# EAGLE design EasyDriver_v44 (EAGLE 5.10)
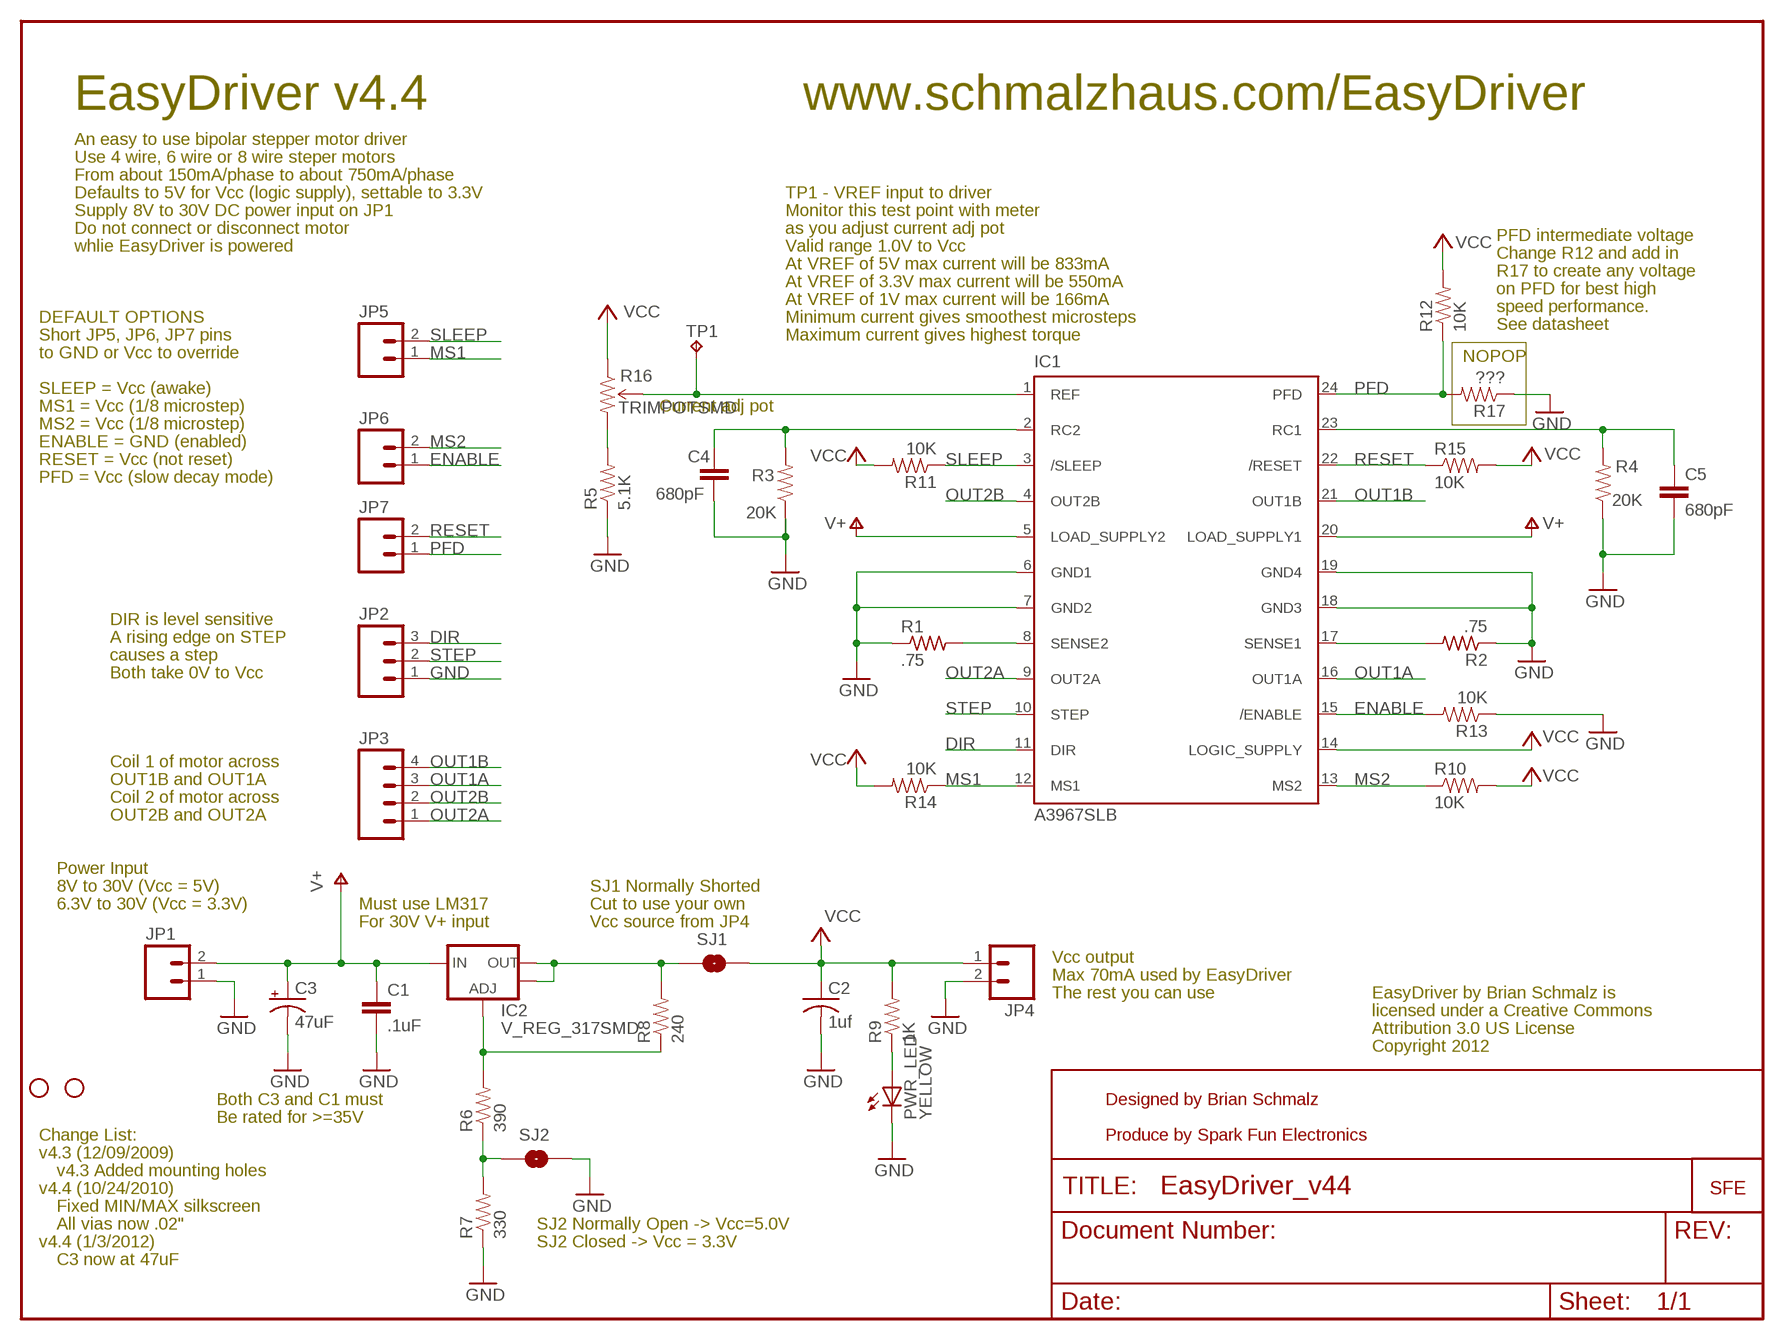
[diagram p0: schematic, sheet 1]

## Parts
C1  .1uF  CAP0603  [0603]
C2  1uf  C-USC0603  [C0603]
C3  47uF  CPOL-USD  [PANASONIC_D]
C4  680pF  CAP0402  [C0402]
C5  680pF  CAP0402  [C0402]
IC1  A3967SLB  [SO24W]
IC2  V_REG_317SMD  [SOT223]
JP1  M021X02_NO_SILK  [1X02_NO_SILK]
JP2  M031X03_NO_SILK  [1X03_NO_SILK]
JP3  M041X04_NO_SILK  [1X04_NO_SILK]
JP4  M021X02_NO_SILK  [1X02_NO_SILK]
JP5  M021X02_NO_SILK  [1X02_NO_SILK]
JP6  M021X02_NO_SILK  [1X02_NO_SILK]
JP7  M021X02_NO_SILK  [1X02_NO_SILK]
JP8  STAND-OFF  [STAND-OFF]
JP9  STAND-OFF  [STAND-OFF]
PWR_LED  YELLOW  LED0603  [LED-0603]
R1  .75  R-US_R0805  [R0805]
R2  .75  R-US_R0805  [R0805]
R3  20K  RESISTOR0402  [C0402]
R4  20K  RESISTOR0402  [C0402]
R5  5.1K  RESISTOR0402  [C0402]
R6  390  RESISTOR0402  [C0402]
R7  330  RESISTOR0402  [C0402]
R8  240  RESISTOR0402  [C0402]
R9  1K  RESISTOR0402  [C0402]
R10  10K  RESISTOR0402  [C0402]
R11  10K  RESISTOR0402  [C0402]
R12  10K  RESISTOR0402  [C0402]
R13  10K  RESISTOR0402  [C0402]
R14  10K  RESISTOR0402  [C0402]
R15  10K  RESISTOR0402  [C0402]
R16  TRIMPOTSMD  [TRIMPOT-3MM]
R17  ???  RESISTOR0402  [C0402]
SJ1  SOLDERJUMPERTRACE  [SJ_2S-TRACE]
SJ2  SOLDERJUMPERNO  [SJ_2S-NO]
TP1  TPPAD1-13  [P1-13]
U$2  LOGO-SFENEW  [SFE-NEW-WEBLOGO]

## Nets
5V_ALT: IC2.2(OUT) IC2.4(OUT) R8.2 SJ1.1
DIR: IC1.11(DIR) JP2.3
ENABLE: IC1.15(/ENABLE) JP6.1 R13.2
GND: C1.2 C2.2 C3.- C4.2 C5.2 IC1.6(GND1) IC1.7(GND2) IC1.18(GND3) IC1.19(GND4) JP1.1 JP2.1 JP4.2 PWR_LED.C R1.1 R2.1 R3.1 R4.1 R5.1 R7.1 R13.1 R17.1 SJ2.2
MS1: IC1.12(MS1) JP5.1 R14.1
MS2: IC1.13(MS2) JP6.2 R10.1
N$1: IC1.8(SENSE2) R1.2
N$2: PWR_LED.A R9.1
N$3: IC1.17(SENSE1) R2.2
N$4: R6.1 R7.2 SJ2.1
N$5: C4.1 IC1.2(RC2) R3.2
N$6: IC2.1(ADJ) R6.2 R8.1
N$7: C5.1 IC1.23(RC1) R4.2
N$11: R5.2 R16.3(CW)
N$12: IC1.1(REF) R16.2(WIPER) TP1.1(TP)
OUT1A: IC1.16(OUT1A) JP3.3
OUT1B: IC1.21(OUT1B) JP3.4
OUT2A: IC1.9(OUT2A) JP3.1
OUT2B: IC1.4(OUT2B) JP3.2
PFD: IC1.24(PFD) JP7.1 R12.1 R17.2
RESET: IC1.22(/RESET) JP7.2 R15.1
SLEEP: IC1.3(/SLEEP) JP5.2 R11.1
STEP: IC1.10(STEP) JP2.2
V+: C1.1 C3.+ IC1.5(LOAD_SUPPLY2) IC1.20(LOAD_SUPPLY1) IC2.3(IN) JP1.2
VCC: C2.1 IC1.14(LOGIC_SUPPLY) JP4.1 R9.2 R10.2 R11.2 R12.2 R14.2 R15.2 R16.1(CCW) SJ1.2

## Notes on the sheet
- EasyDriver v4.4 | www.schmalzhaus.com/EasyDriver
- An easy to use bipolar stepper motor driver
- Use 4 wire, 6 wire or 8 wire steper motors
- From about 150mA/phase to about 750mA/phase
- Defaults to 5V for Vcc (logic supply), settable to 3.3V | TP1 - VREF input to driver
- Supply 8V to 30V DC power input on JP1 | Monitor this test point with meter
- Do not connect or disconnect motor | as you adjust current adj pot
- PFD intermediate voltage
- whlie EasyDriver is powered | Valid range 1.0V to Vcc
- Change R12 and add in
- At VREF of 5V max current will be 833mA
- R17 to create any voltage
- At VREF of 3.3V max current will be 550mA
- on PFD for best high
- At VREF of 1V max current will be 166mA
- speed performance.
- DEFAULT OPTIONS | Minimum current gives smoothest microsteps
- See datasheet
- Short JP5, JP6, JP7 pins | Maximum current gives highest torque
- to GND or Vcc to override | NOPOP
- SLEEP = Vcc (awake)
- MS1 = Vcc (1/8 microstep) | Current adj pot
- MS2 = Vcc (1/8 microstep)
- ENABLE = GND (enabled)
- RESET = Vcc (not reset)
- PFD = Vcc (slow decay mode)
- DIR is level sensitive
- A rising edge on STEP
- causes a step
- Both take 0V to Vcc
- Coil 1 of motor across
- OUT1B and OUT1A
- Coil 2 of motor across
- OUT2B and OUT2A
- Power Input
- 8V to 30V (Vcc = 5V) | SJ1 Normally Shorted
- 6.3V to 30V (Vcc = 3.3V) | Must use LM317 | Cut to use your own
- For 30V V+ input | Vcc source from JP4
- Vcc output
- Max 70mA used by EasyDriver
- The rest you can use | EasyDriver by Brian Schmalz is
- licensed under a Creative Commons
- Attribution 3.0 US License
- Copyright 2012
- Both C3 and C1 must | Designed by Brian Schmalz
- Be rated for >=35V
- Change List: | Produce by Spark Fun Electronics
- v4.3 (12/09/2009)
- v4.3 Added mounting holes
- v4.4 (10/24/2010)
- Fixed MIN/MAX silkscreen
- All vias now .02" | SJ2 Normally Open -> Vcc=5.0V
- v4.4 (1/3/2012) | SJ2 Closed -> Vcc = 3.3V
- C3 now at 47uF

## Library data of the parts
C1 = SparkFun-2-11-09:CAP: Capacitor Standard 0603 ceramic capacitor, and 0.1" leaded capacitor.
C2 = rcl:C-US: CAPACITOR, American symbol
C3 = rcl:CPOL-US: POLARIZED CAPACITOR, American symbol
C4 C5 = SparkFun03_30_09:CAP: Capacitor Standard 0603 ceramic capacitor, and 0.1" leaded capacitor.
IC1 = Allegro:A3967SLB: ANALOG DEVICES
IC2 = SparkFun03_30_09:V_REG_317: Voltage Regulator Standard LM317 adjustable voltage regulator. AOI (Adjust Output Input). Google 'LM317 Calculator' for easy to use app to get the two resistor values needed. 240/720 for 5V output. 240/390 for 3.3V output. Spark Fun Electronics SKU : COM-00527
JP1 JP4-JP7 = SparkFun:M02: Header 2 Standard 2-pin 0.1" header. Use with straight break away headers (SKU : PRT-00116), right angle break away headers (PRT-00553), swiss pins (PRT-00743), machine pins (PRT-00117), and female headers (PRT-00115). Molex polarized connector foot print use with SKU : PRT-08233 with associated crimp pins and housings.
JP2 = SparkFun:M03: Header 3 Standard 3-pin 0.1" header. Use with straight break away headers (SKU : PRT-00116), right angle break away headers (PRT-00553), swiss pins (PRT-00743), machine pins (PRT-00117), and female headers (PRT-00115). Molex polarized connector foot print use with SKU : PRT-08232 with associated crimp pins and housings.
JP3 = SparkFun:M04: Header 4 Standard 4-pin 0.1" header. Use with straight break away headers (SKU : PRT-00116), right angle break away headers (PRT-00553), swiss pins (PRT-00743), machine pins (PRT-00117), and female headers (PRT-00115). Molex polarized connector foot print use with SKU : PRT-08231 with associated crimp pins and housings.
JP8 JP9 = SparkFun-7-28-09:STAND-OFF: Stand Off This is the mechanical footprint for a #4 phillips button head screw. Use the keepout ring to avoid running the screw head into surrounding components. SKU : PRT-00447
PWR_LED = SparkFun03_30_09:LED: LEDs Standard schematic elements and footprints for 5mm, 3mm, 1206, and 0603 sized LEDs. 5mm - Spark Fun Electronics SKU : COM-00529 (and others)
R1 R2 = rcl:R-US_: RESISTOR, American symbol
R3-R15 R17 = SparkFun03_30_09:RESISTOR: Resistor Basic schematic elements and footprints for 0603, 1206, and PTH 1/10th watt (small) resistors.
R16 = SparkFun:TRIMPOT
SJ1 SJ2 = SparkFun03_30_09:SOLDERJUMPER: Solder Jumper Standard SMD solder jumper. Used to automate production. Two varients : Normally Open and Normally Closed are the same, but have different paste layers. NC will have a large amount of paste and should jumper during reflow.
TP1 = testpad:TP
U$2 = SparkFun:LOGO-SFE: Spark Fun Electronics PCB Logo This is the standard Spark Fun Electronics PCB logo.

## Board
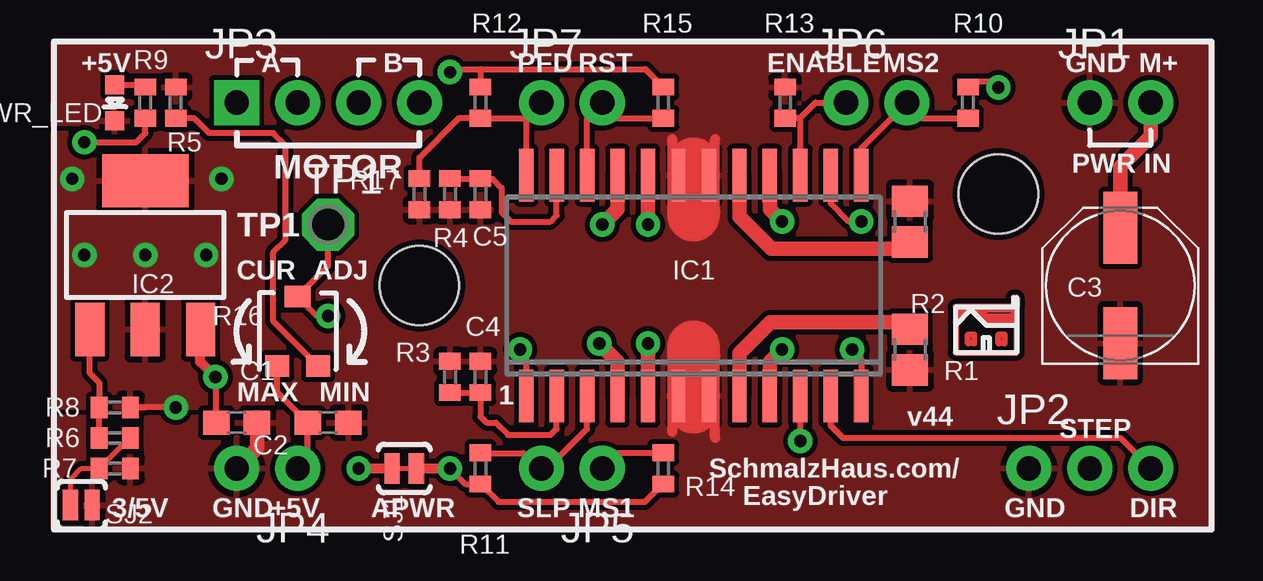
[diagram p1: board, top side]
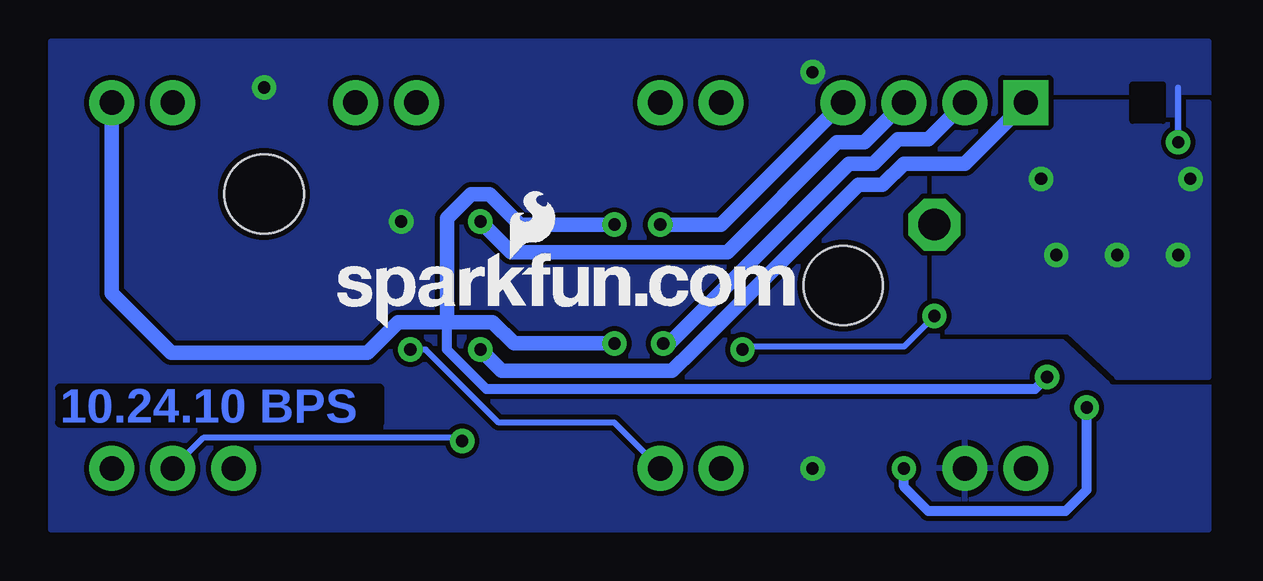
[diagram p2: board, bottom side, seen from below]

No outline drawn. Coordinates in mm, seen from the top.
Copper layers (1*16): Top 0.035mm / dielectric 1.5mm / Bottom 0.035mm
Design rules "GoldPhoenix_8and8": minimum track width 7mil, minimum drill 15mil, track to track 8mil, track to pad 8mil, pad to pad 8mil, via to via 8mil, smd to smd 8mil, copper to edge 10mil, drill to drill 8mil, minimum pad ring 12mil, minimum via ring 10mil, stop-mask expansion 4mil, vias tented up to drill 25mil, thermal gap 10mil
bRestrict: area 1.9,17 to 3.2,18.5

### Footprints (pad centres in the part's own frame; a part is rotated, then mirrored left to right if it is on the bottom)
0603 = smd 1.1 x 1: 1 -0.85,0; 2 0.85,0
C0603 = smd 1.1 x 1: 1 -0.85,0; 2 0.85,0
PANASONIC_D = smd 3 x 1.4: + 2.4,0; - -2.4,0
C0402 = smd 0.7 x 0.9: 1 -0.65,0; 2 0.65,0
SO24W = smd 0.6 x 2.2: 1 -6.985,-4.6; 2 -5.715,-4.6; 3 -4.445,-4.6; 4 -3.175,-4.6; 5 -1.905,-4.6; 6 -0.635,-4.6; 7 0.635,-4.6; 8 1.905,-4.6; 9 3.175,-4.6; 10 4.445,-4.6; 11 5.715,-4.6; 12 6.985,-4.6; 13 6.985,4.6; 14 5.715,4.6; 15 4.445,4.6; 16 3.175,4.6; 17 1.905,4.6; 18 0.635,4.6; 19 -0.635,4.6; 20 -1.905,4.6; 21 -3.175,4.6; 22 -4.445,4.6; 23 -5.715,4.6; 24 -6.985,4.6
SOT223 = smd 1.219 x 2.235: 1 -2.311,-3.099; 2 0,-3.099; 3 2.311,-3.099 | smd 3.6 x 2.2: 4 0,3.099
1X02_NO_SILK = drill 1.016 pad 1.88 round: 1 0,0; 2 2.54,0
1X03_NO_SILK = drill 1.016 pad 1.88 round: 1 0,0; 2 2.54,0; 3 5.08,0
1X04_NO_SILK = drill 1.016 pad 1.88 square: 1 0,0 | drill 1.016 pad 1.88 round: 2 2.54,0; 3 5.08,0; 4 7.62,0
STAND-OFF = hole 3.302: 0,0
LED-0603 = smd 0.8 x 0.8: A 0,-0.75; C 0,0.75
R0805 = smd 1.3 x 1.5: 1 -0.85,0; 2 0.85,0
TRIMPOT-3MM = smd 1 x 0.9: 1 -0.85,-1.45; 3 0.85,-1.45 | smd 1.1 x 0.9: 2 0,1.45
SJ_2S-TRACE = smd 0.635 x 1.27: 1 -0.508,0; 2 0.508,0
SJ_2S-NO = smd 0.635 x 1.27: 1 -0.45,0; 2 0.45,0
P1-13 = drill 1.321 pad 2.159 octagon: 1 0,0

### Placement (x,y rotation side)
C1  7.62,4.45 0 top
C2  11.43,4.45 0 top
C3  44.45,10.16 90 top
C4  17.78,6.35 90 top
C5  17.78,13.97 270 top
IC1  26.67,10.16 0 top
IC2  3.81,11.43 0 top
JP1  43.18,17.78 0 top
JP2  40.64,2.54 0 top
JP3  7.62,17.78 0 top
JP4  10.16,2.54 180 top
JP5  22.86,2.54 180 top
JP6  33.02,17.78 0 top
JP7  20.32,17.78 0 top
JP8  39.37,13.97 0 top
JP9  15.24,10.16 0 top
PWR_LED  2.54,17.78 180 top
R1  35.69,7.49 90 top
R2  35.69,12.83 270 top
R3  16.51,6.35 270 top
R4  16.51,13.97 90 top
R5  5.08,17.78 270 top
R6  2.54,3.81 180 top
R7  2.54,2.54 180 top
R8  2.54,5.08 0 top
R9  3.81,17.78 270 top
R10  38.1,17.78 90 top
R11  17.78,2.54 270 top
R12  17.78,17.78 90 top
R13  30.48,17.78 270 top
R14  25.4,2.54 270 top
R15  25.4,17.78 90 top
R16  10.16,8.26 0 top
R17  15.24,13.97 90 top
SJ1  14.61,2.54 0 top
SJ2  1.14,1.02 0 top
TP1  11.43,12.7 0 top
U$1  [SCHMALZHAUS_SMALL]  38.86,7.37 0 top
U$2  36.32,8.38 0 bottom

### Tracks (layer width: path | path; a pad name or v marks a point on that pad's centre or on a via)
5V_ALT  (via drill 0.51)
  Top 0.254: 3.81,5.08 R8.2 v5.08,5.08
  Top 0.406: v12.7,2.54 SJ1.1
  Bottom 0.406: v5.08,5.08 5.08,1.65 5.97,0.76 11.68,0.76 12.7,1.78 v12.7,2.54
  other vias: 1.27,11.43 3.81,11.43 6.35,11.43 6.99,14.61 0.76,14.61
  pour Top (rank 2): 0,5.08 0,16.51 10.16,16.51 10.16,5.08
  pour Bottom (rank 2): 0,17.78 7.62,17.78 10.16,15.24 11.43,15.24 11.43,8.26 5.84,8.26 3.81,6.35 0,6.35
DIR
  Top 0.254: IC1.11 32.38,4.32 32.89,3.81 44.45,3.81 JP2.3
ENABLE
  Top 0.254: IC1.15 31.11,17.14 | 31.11,17.14 31.75,17.78 JP6.1 | R13.2 31.1,17.13 31.11,17.14
GND
  Top 0.406: 27.56,3.81 27.56,7.24 | 27.56,13.21 27.56,16.26 | 25.78,13.21 25.78,16.26 | 25.78,4.06 25.78,6.99
  Top 0.61: C1.2 8.47,3.39 JP4.2
  Top 2.184: 26.67,13.08 26.67,15.24 | 26.67,5.08 26.67,7.62
  pour Top (rank 3): 0,0 0,5.08 0,20.32 48.26,20.32 48.26,0
  pour Bottom (rank 3): 15.24,17.78 17.65,15.24 17.78,15.37 17.65,15.37
MS1  (via drill 0.51)
  Top 0.254: IC1.12 33.66,7.11 v33.27,7.49 | R14.1 23.51,3.19 JP5.1
  Bottom 0.254: v33.27,7.49 32.64,7.49 29.59,4.45 24.77,4.45 JP5.1
MS2
  Top 0.254: IC1.13 33.66,15.88 JP6.2 36.21,17.13 R10.1
N$1
  Top 0.406: 35.31,8.64 35.69,8.64 R1.2
  Top 0.61: IC1.8 28.57,7.34 29.87,8.64 35.31,8.64
N$2
  Top 0.254: PWR_LED.A 3.81,18.53 R9.1
N$3
  Top 0.406: 35.31,11.68 35.69,11.68 R2.2
  Top 0.61: IC1.17 28.57,13.02 29.91,11.68 35.31,11.68
N$4
  Top 0.203: R6.1 3.16,3.81 R7.2 1.14,2.54 0.69,2.09 SJ2.1
N$5
  Top 0.254: R3.2 C4.1 17.78,4.7 18.03,4.45 18.41,4.45 18.92,3.94 20.7,3.94 20.95,4.19 IC1.2
N$6
  Top 0.254: R6.2 R8.1 | 1.91,5.08 1.91,6.1 1.5,6.5 IC2.1
  Top 0.406: 1.27,8.1 1.5,8.1 IC2.1 | R8.1 1.91,5.08
N$7
  Top 0.254: IC1.23 20.95,13.08 20.7,12.83 19.05,12.83 18.67,13.21 18.67,14.22 18.29,14.61 17.8,14.61 C5.1 R4.2
N$11
  Top 0.254: R5.2 5.86,17.13 6.48,16.51 9.14,16.51 9.65,16 9.65,12.05 9.14,11.54 9.14,8.67 R16.3
N$12  (via drill 0.51)
  Top 0.254: IC1.1 19.68,7.24 v19.43,7.49 | TP1.1 11.43,10.97 R16.2 10.97,8.89 v11.43,8.89
  Bottom 0.254: v19.43,7.49 19.3,7.62 12.7,7.62 v11.43,8.89
OUT1A  (via drill 0.51)
  Top 0.406: IC1.16 29.94,14.76
  Top 0.61: 29.84,14.86 IC1.16 29.84,13.34 v30.35,12.83
  Bottom 0.61: v30.35,12.83 29.08,11.56 20.07,11.56 15.49,16.13 14.35,16.13 JP3.3
OUT1B  (via drill 0.51)
  Top 0.61: v22.86,12.7 23.5,13.34 IC1.21
  Bottom 0.61: v22.86,12.7 20.32,12.7 JP3.4
OUT2A  (via drill 0.51)
  Top 0.406: IC1.9 29.75,5.56
  Top 0.61: 29.84,5.46 IC1.9 29.84,6.99 v30.35,7.49
  Bottom 0.406: 21.46,7.49 21.47,7.49
  Bottom 0.61: 21.46,7.49 14.61,14.35 13.59,14.35 12.7,15.24 10.16,15.24 JP3.1 | v30.35,7.49 29.46,6.6 22.36,6.6 21.47,7.49
OUT2B  (via drill 0.51)
  Top 0.61: v22.73,7.75 23.5,6.99 IC1.4
  Bottom 0.61: JP3.2 11.68,16.26 12.95,16.26 13.97,15.24 14.99,15.24 22.48,7.75 v22.73,7.75
PFD
  Top 0.254: 19.68,14.73 IC1.24 19.68,17.14 19.67,17.13 | 17.8,17.13 19.67,17.13 | R17.2 15.24,15.49 16.89,17.14 17.77,17.14 R12.1 | 19.67,17.13 JP7.1
  Top 0.406: R12.1 17.8,17.13
RESET
  Top 0.254: IC1.22 22.23,17.14 JP7.2 23.51,17.13 R15.1
SLEEP
  Top 0.254: 17.8,3.17 19.56,3.17 20.19,2.54 JP5.2 20.57,2.54 22.23,4.19 IC1.3
  Top 0.305: IC1.3 22.23,5.59
  Top 0.406: R11.1 17.8,3.17
STEP  (via drill 0.51)
  Top 0.254: v31.11,3.68 IC1.10
  Bottom 0.254: v31.11,3.68 31.24,3.81 41.91,3.81 JP2.2
V+  (via drill 0.51)
  Top 0.254: C1.1 6.77,6.31 v6.73,6.35
  Top 0.406: v6.73,6.35 6.1,6.99 6.1,8.31 6.12,8.31 IC2.3
  Top 0.61: v24.77,12.7 IC1.20 | v24.77,7.75 IC1.5 | C3.+ 44.45,15.11 45.72,16.38 JP1.2
  Bottom 0.406: 31.75,8.64 31.75,7.49 30.1,5.84 7.24,5.84 v6.73,6.35
  Bottom 0.61: v24.77,7.75 28.96,7.75 29.84,8.64 31.75,8.64 | 31.75,8.64 33.78,8.64 35.05,7.37 43.25,7.37 45.72,9.83 JP1.2 | v24.77,12.7 28.7,12.7 29.97,13.97 30.73,13.97 31.75,12.95 31.75,8.64
VCC  (via drill 0.51)
  Top 0.254: IC1.14 32.38,13.59 33.15,12.83 v33.66,12.83 | 39.35,18.43 v39.37,18.41 39.12,18.67 38.1,18.67 R10.2 | R15.2 24.65,19.18 17.78,19.18 | 17.78,19.18 16.64,19.18 v16.51,19.05 | 17.78,19.18 R12.2 | v16.51,2.54 17.16,1.89 R11.2 18.53,1.14 24.64,1.14 25.18,1.69 25.4,1.69 R14.2 | R9.2 3.81,16.51 3.43,16.13 v1.27,16.13 | R16.1 9.31,5.71 C2.1 10.58,2.96 JP4.1
  Top 0.406: R15.2 25.41,18.43 | SJ1.2 v16.51,2.54
  Bottom 0.254: v1.27,16.13 1.27,18.41
  pour Bottom (rank 4): 0,0 0,20.32 48.26,20.32 48.26,0

### Text on the board
Bottom: 10.24.10 BPS
tPlace: +5V | A | B | PFD | RST | ENABLE | MS2 | GND | M+ | MOTOR | PWR IN | TP1 | CUR | ADJ | MAX | MIN | 1 | v44 | STEP | SchmalzHaus.com/ | 3/5V | GND | +5V | APWR | SLP | MS1 | EasyDriver | GND | DIR